# EAGLE design oledBreakout (EAGLE 6.5.0)
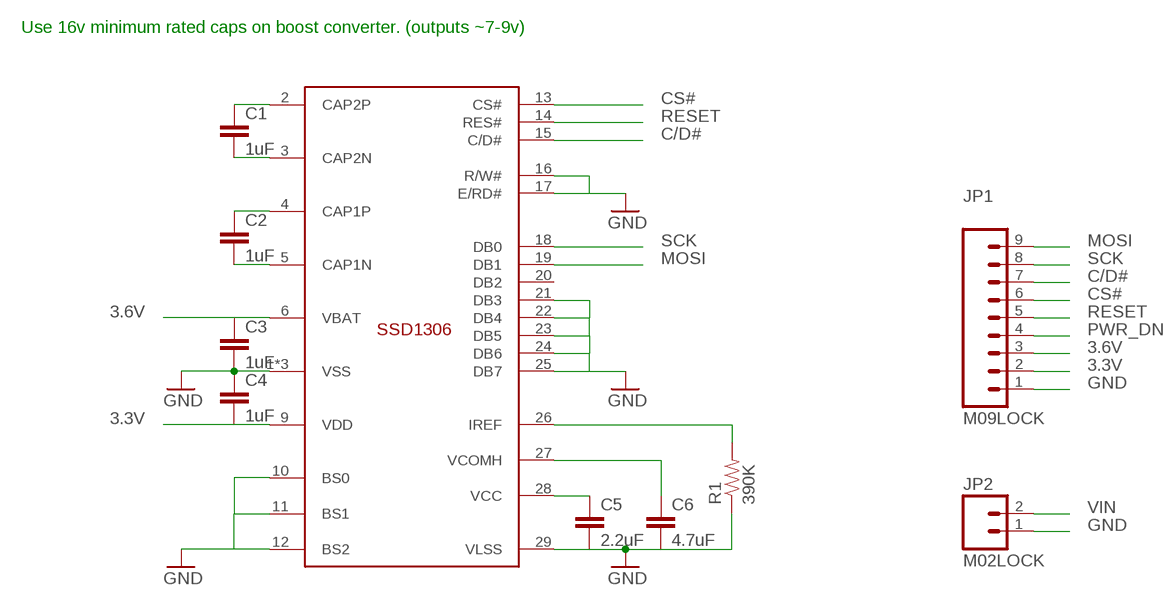
[diagram p0: schematic, sheet 1]

## Parts
C1  1uF  CAP0402-CAP  [0402-CAP]
C2  1uF  CAP0402-CAP  [0402-CAP]
C3  1uF  CAP0402-CAP  [0402-CAP]
C4  1uF  CAP0402-CAP  [0402-CAP]
C5  2.2uF  CAP0402-CAP  [0402-CAP]
C6  4.7uF  CAP0402-CAP  [0402-CAP]
JP1  M09LOCK  [1X09_LOCK]
JP2  M02LOCK  [1X02_LOCK]
R1  390K  RESISTOR0402-RES  [0402-RES]
U$1  ER-OLED0.96-2  [ER-OLED0.96-2]

## Nets
3.3V: C4.2 JP1.2 U$1.9(VDD)
3.6V: C3.1 JP1.3 U$1.6(VBAT)
C/D#: JP1.7 U$1.15(C/D#)
CS#: JP1.6 U$1.13(CS#)
GND: C3.2 C4.1 C5.2 C6.2 JP1.1 JP2.1 R1.1 U$1.1(VSS) U$1.8(VSS) U$1.10(BS0) U$1.11(BS1) U$1.12(BS2) U$1.16(R/W#) U$1.17(E/RD#) U$1.21(DB3) U$1.22(DB4) U$1.23(DB5) U$1.24(DB6) U$1.25(DB7) U$1.29(VLSS) U$1.30(VSS)
MOSI: JP1.9 U$1.19(DB1)
N$2: C5.1 U$1.28(VCC)
N$3: C6.1 U$1.27(VCOMH)
N$4: R1.2 U$1.26(IREF)
N$9: C2.2 U$1.5(CAP1N)
N$10: C2.1 U$1.4(CAP1P)
N$11: C1.2 U$1.3(CAP2N)
N$12: C1.1 U$1.2(CAP2P)
PWR_DN: JP1.4
RESET: JP1.5 U$1.14(RES#)
SCK: JP1.8 U$1.18(DB0)
VIN: JP2.2
Unconnected: U$1.20(DB2)

## Notes on the sheet
- Use 16v minimum rated caps on boost converter. (outputs ~7-9v)

## Library data of the parts
C1-C6 = chips:CAP: Capacitor Standard 0603 ceramic capacitor, and 0.1" leaded capacitor.
JP1 = SparkFun-Connectors:M09: Header 9 Standard 9-pin 0.1" header. Use with straight break away headers (SKU : PRT-00116), right angle break away headers (PRT-00553), swiss pins (PRT-00743), machine pins (PRT-00117), and female headers (PRT-00115).
JP2 = SparkFun-Connectors:M02: Standard 2-pin 0.1" header. Use with - straight break away headers ( PRT-00116) - right angle break away headers (PRT-00553) - swiss pins (PRT-00743) - machine pins (PRT-00117) - female headers (PRT-00115) Molex polarized connector foot print use with: PRT-08233 with associated crimp pins and housings. 2.54_SCREWTERM for use with PRT-10571. 3.5mm Screw Terminal footprints for PRT-08084 5mm Screw Terminal footprints for use with PRT-08433
R1 = chips:RESISTOR: Resistor Basic schematic elements and footprints for 0603, 1206, and PTH resistors.
U$1 = intelliDesk:ER-OLED0.96-2

## Board
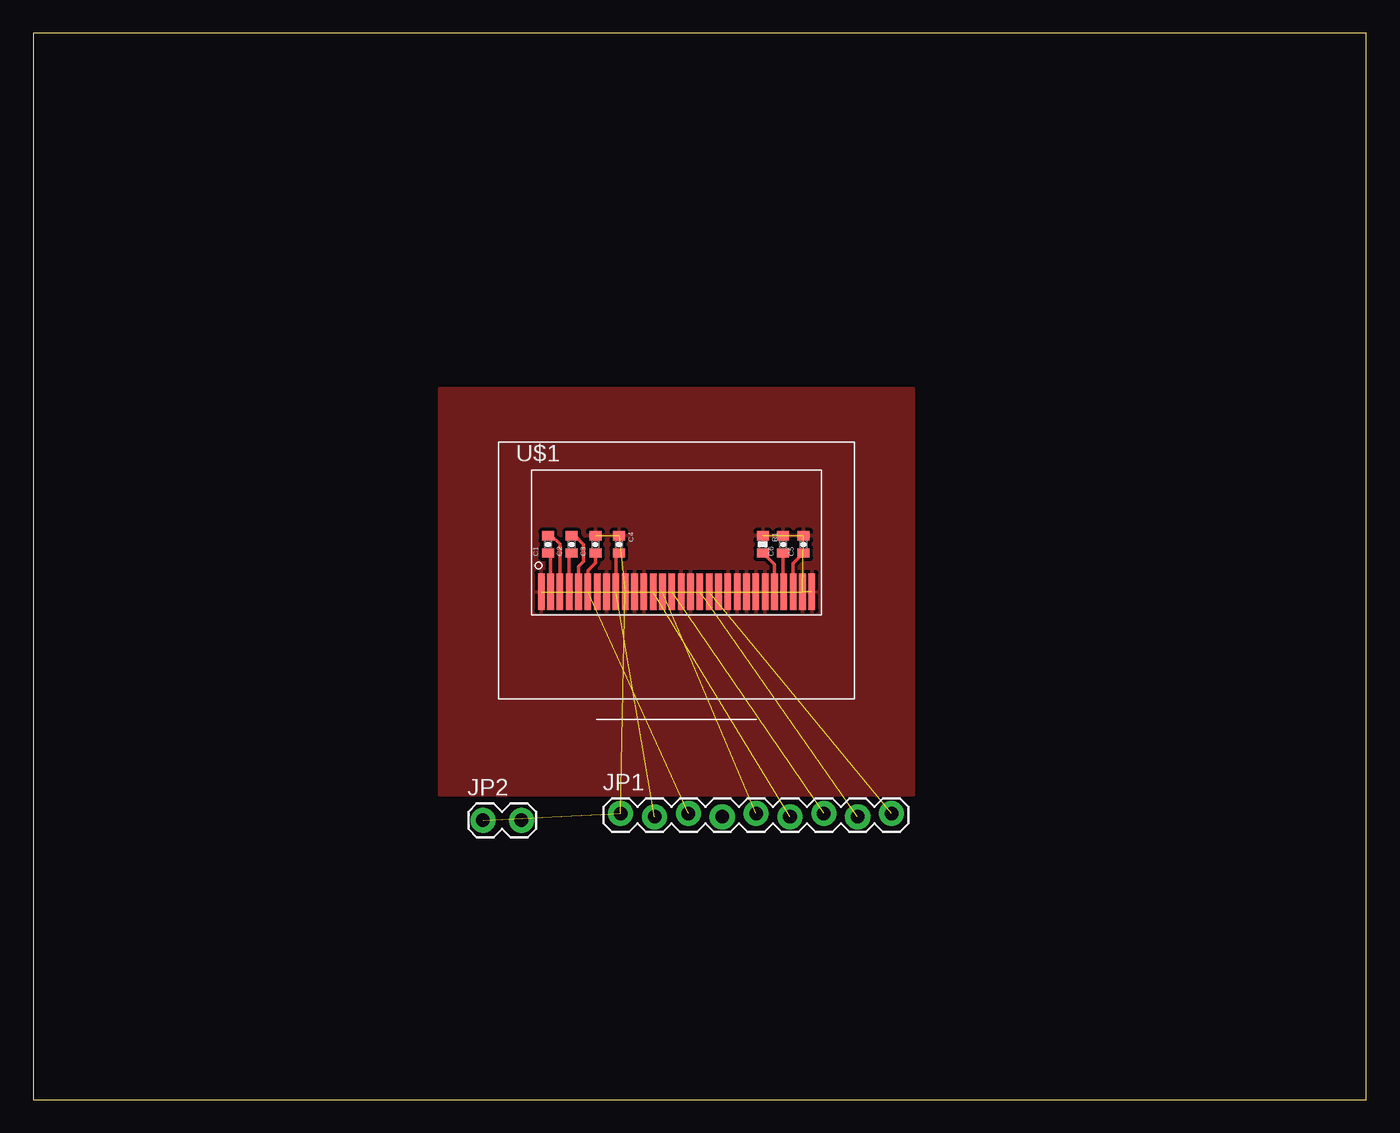
[diagram p1: board, top side]

Size 100 x 80 mm. Coordinates in mm from the lower left corner, seen from the top.
Outline: 0,0 100,0 100,80 0,80 0,0
Copper layers (1*16): Top 0.035mm / dielectric 1.5mm / Bottom 0.035mm
Design rules "default": minimum track width 10mil, minimum drill 24mil, track to track 8mil, track to pad 8mil, pad to pad 8mil, via to via 8mil, smd to smd 8mil, copper to edge 40mil, drill to drill 8mil, minimum pad ring 10mil, minimum via ring 8mil, stop-mask expansion 4mil, vias tented up to drill 0mil, thermal gap 10mil

### Footprints (pad centres in the part's own frame; a part is rotated, then mirrored left to right if it is on the bottom)
0402-CAP = smd 0.7 x 0.9: 1 -0.65,0; 2 0.65,0
1X09_LOCK = drill 1.016 pad 1.88: 1 0,0.127; 2 2.54,-0.127; 3 5.08,0.127; 4 7.62,-0.127; 5 10.16,0.127; 6 12.7,-0.127; 7 15.24,0.127; 8 17.78,-0.127; 9 20.32,0.127
1X02_LOCK = drill 1.016 pad 1.88: 1 -0.178,0; 2 2.718,0
0402-RES = smd 0.7 x 0.9: 1 -0.65,0; 2 0.65,0
ER-OLED0.96-2 = smd 0.5 x 2.75: 1 0,0; 2 0.7,0; 3 1.4,0; 4 2.1,0; 5 2.8,0; 6 3.5,0; 7 4.2,0; 8 4.9,0; 9 5.6,0; 10 6.3,0; 11 7,0; 12 7.7,0; 13 8.4,0; 14 9.1,0; 15 9.8,0; 16 10.5,0; 17 11.2,0; 18 11.9,0; 19 12.6,0; 20 13.3,0; 21 14,0; 22 14.7,0; 23 15.4,0; 24 16.1,0; 25 16.8,0; 26 17.5,0; 27 18.2,0; 28 18.9,0; 29 19.6,0; 30 20.3,0

### Placement (x,y rotation side)
C1  38.61,41.66 90 top
C2  40.39,41.66 90 top
C3  42.16,41.66 90 top
C4  43.94,41.66 270 top
C5  57.78,41.66 90 top
C6  56.26,41.66 90 top
JP1  44.07,21.34 0 top
JP2  33.91,20.95 0 top
R1  54.74,41.66 270 top
U$1  38.1,38.1 0 top

### Tracks (layer width: path | path; a pad name or v marks a point on that pad's centre or on a via)
3.3V  (1 unrouted)
  Top 0.254: C4.2 43.7,40.89 U$1.9
3.6V  (1 unrouted)
  Top 0.254: C3.1 42.16,40.26 41.6,39.7 U$1.6
C/D#  (1 unrouted)
CS#  (1 unrouted)
GND  (20 unrouted)
  pour Top (isolate 0.254): 30.48,53.34 66.04,53.34 66.04,22.86 30.48,22.86
MOSI  (1 unrouted)
N$2
  Top 0.254: U$1.28 57,40.22 C5.1
N$3
  Top 0.254: C6.1 56.26,38.14 U$1.27
N$4
  Top 0.254: U$1.26 55.6,40.14 R1.2
N$9
  Top 0.254: U$1.5 40.89,40.01 41.27,40.39 41.27,41.66 40.62,42.31 C2.2 40.4,42.29
N$10
  Top 0.254: C2.1 40.2,40.82 U$1.4
N$11
  Top 0.254: U$1.3 39.5,41.67 38.86,42.31 C1.2
N$12
  Top 0.254: U$1.2 38.8,40.81 C1.1
RESET  (1 unrouted)
SCK  (1 unrouted)